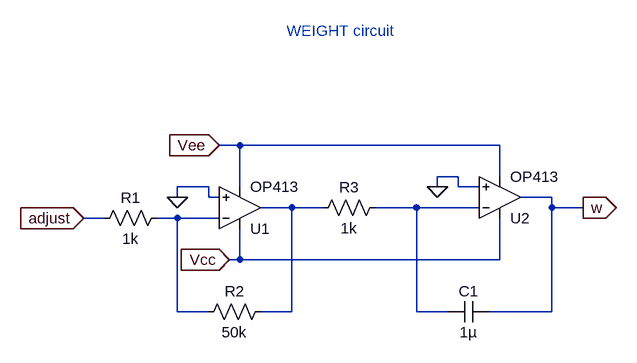
[diagram p0: schematic Weight.asc]
Weight.asc, the LTspice schematic file:
Version 4
SHEET 1 880 680
WIRE 112 80 80 80
WIRE 512 80 112 80
WIRE 448 128 416 128
WIRE 512 128 512 80
WIRE 64 144 16 144
WIRE 112 144 112 80
WIRE 416 144 416 128
WIRE 448 144 448 128
WIRE 480 144 448 144
WIRE 16 160 16 144
WIRE 64 160 64 144
WIRE 80 160 64 160
WIRE 592 160 544 160
WIRE 192 176 144 176
WIRE 240 176 192 176
WIRE 384 176 320 176
WIRE 480 176 384 176
WIRE 592 176 592 160
WIRE 640 176 592 176
WIRE -96 192 -128 192
WIRE 16 192 -16 192
WIRE 80 192 16 192
WIRE 112 256 112 208
WIRE 112 256 96 256
WIRE 512 256 512 192
WIRE 512 256 112 256
WIRE 16 336 16 192
WIRE 64 336 16 336
WIRE 192 336 192 176
WIRE 192 336 144 336
WIRE 384 336 384 176
WIRE 432 336 384 336
WIRE 592 336 592 176
WIRE 592 336 496 336
FLAG 416 144 0
FLAG 16 160 0
FLAG -128 192 adjust
IOPIN -128 192 In
FLAG 640 176 w
IOPIN 640 176 Out
FLAG 96 256 Vcc
IOPIN 96 256 In
FLAG 80 80 Vee
IOPIN 80 80 In
SYMBOL res 336 160 R90
WINDOW 0 0 56 VBottom 2
WINDOW 3 32 56 VTop 2
SYMATTR InstName R3
SYMATTR Value 1k
SYMBOL res 0 176 R90
WINDOW 0 0 56 VBottom 2
WINDOW 3 32 56 VTop 2
SYMATTR InstName R1
SYMATTR Value 1k
SYMBOL res 160 320 R90
WINDOW 0 0 56 VBottom 2
WINDOW 3 32 56 VTop 2
SYMATTR InstName R2
SYMATTR Value 50k
SYMBOL cap 496 320 R90
WINDOW 0 0 32 VBottom 2
WINDOW 3 32 32 VTop 2
SYMATTR InstName C1
SYMATTR Value 1µ
SYMBOL OpAmps\\OP413 112 240 M180
SYMATTR InstName U1
SYMBOL OpAmps\\OP413 512 224 M180
SYMATTR InstName U2
TEXT 184 -96 Left 2 ;WEIGHT circuit

The netlist it stands for:
* Weight.asc
R3 N002 N001 1k
R1 N003 adjust 1k
R2 N001 N003 50k
C1 w N002 1µ
XU1 0 N003 Vcc Vee N001 OP413  ; pins In+ In- V+ V- OUT
XU2 0 N002 Vcc Vee w OP413  ; pins In+ In- V+ V- OUT
* WEIGHT circuit
.backanno
.end